# EAGLE schematic avionics_pcb_draft (EAGLE 7.6.0)

## Sheet 1 of 2
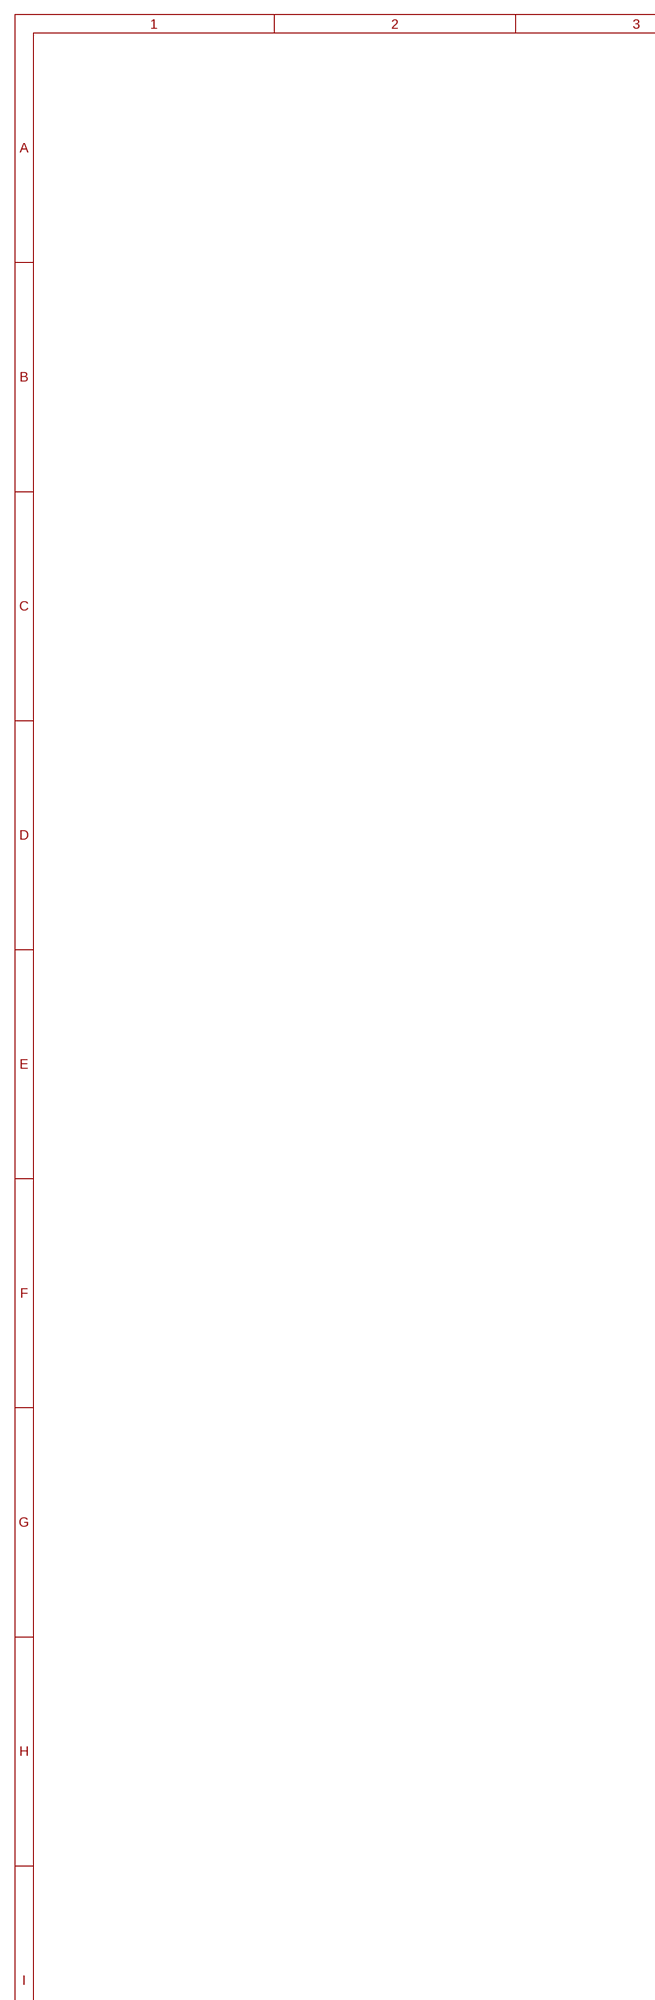
[diagram p0: schematic, sheet 1, part 1 of 2]
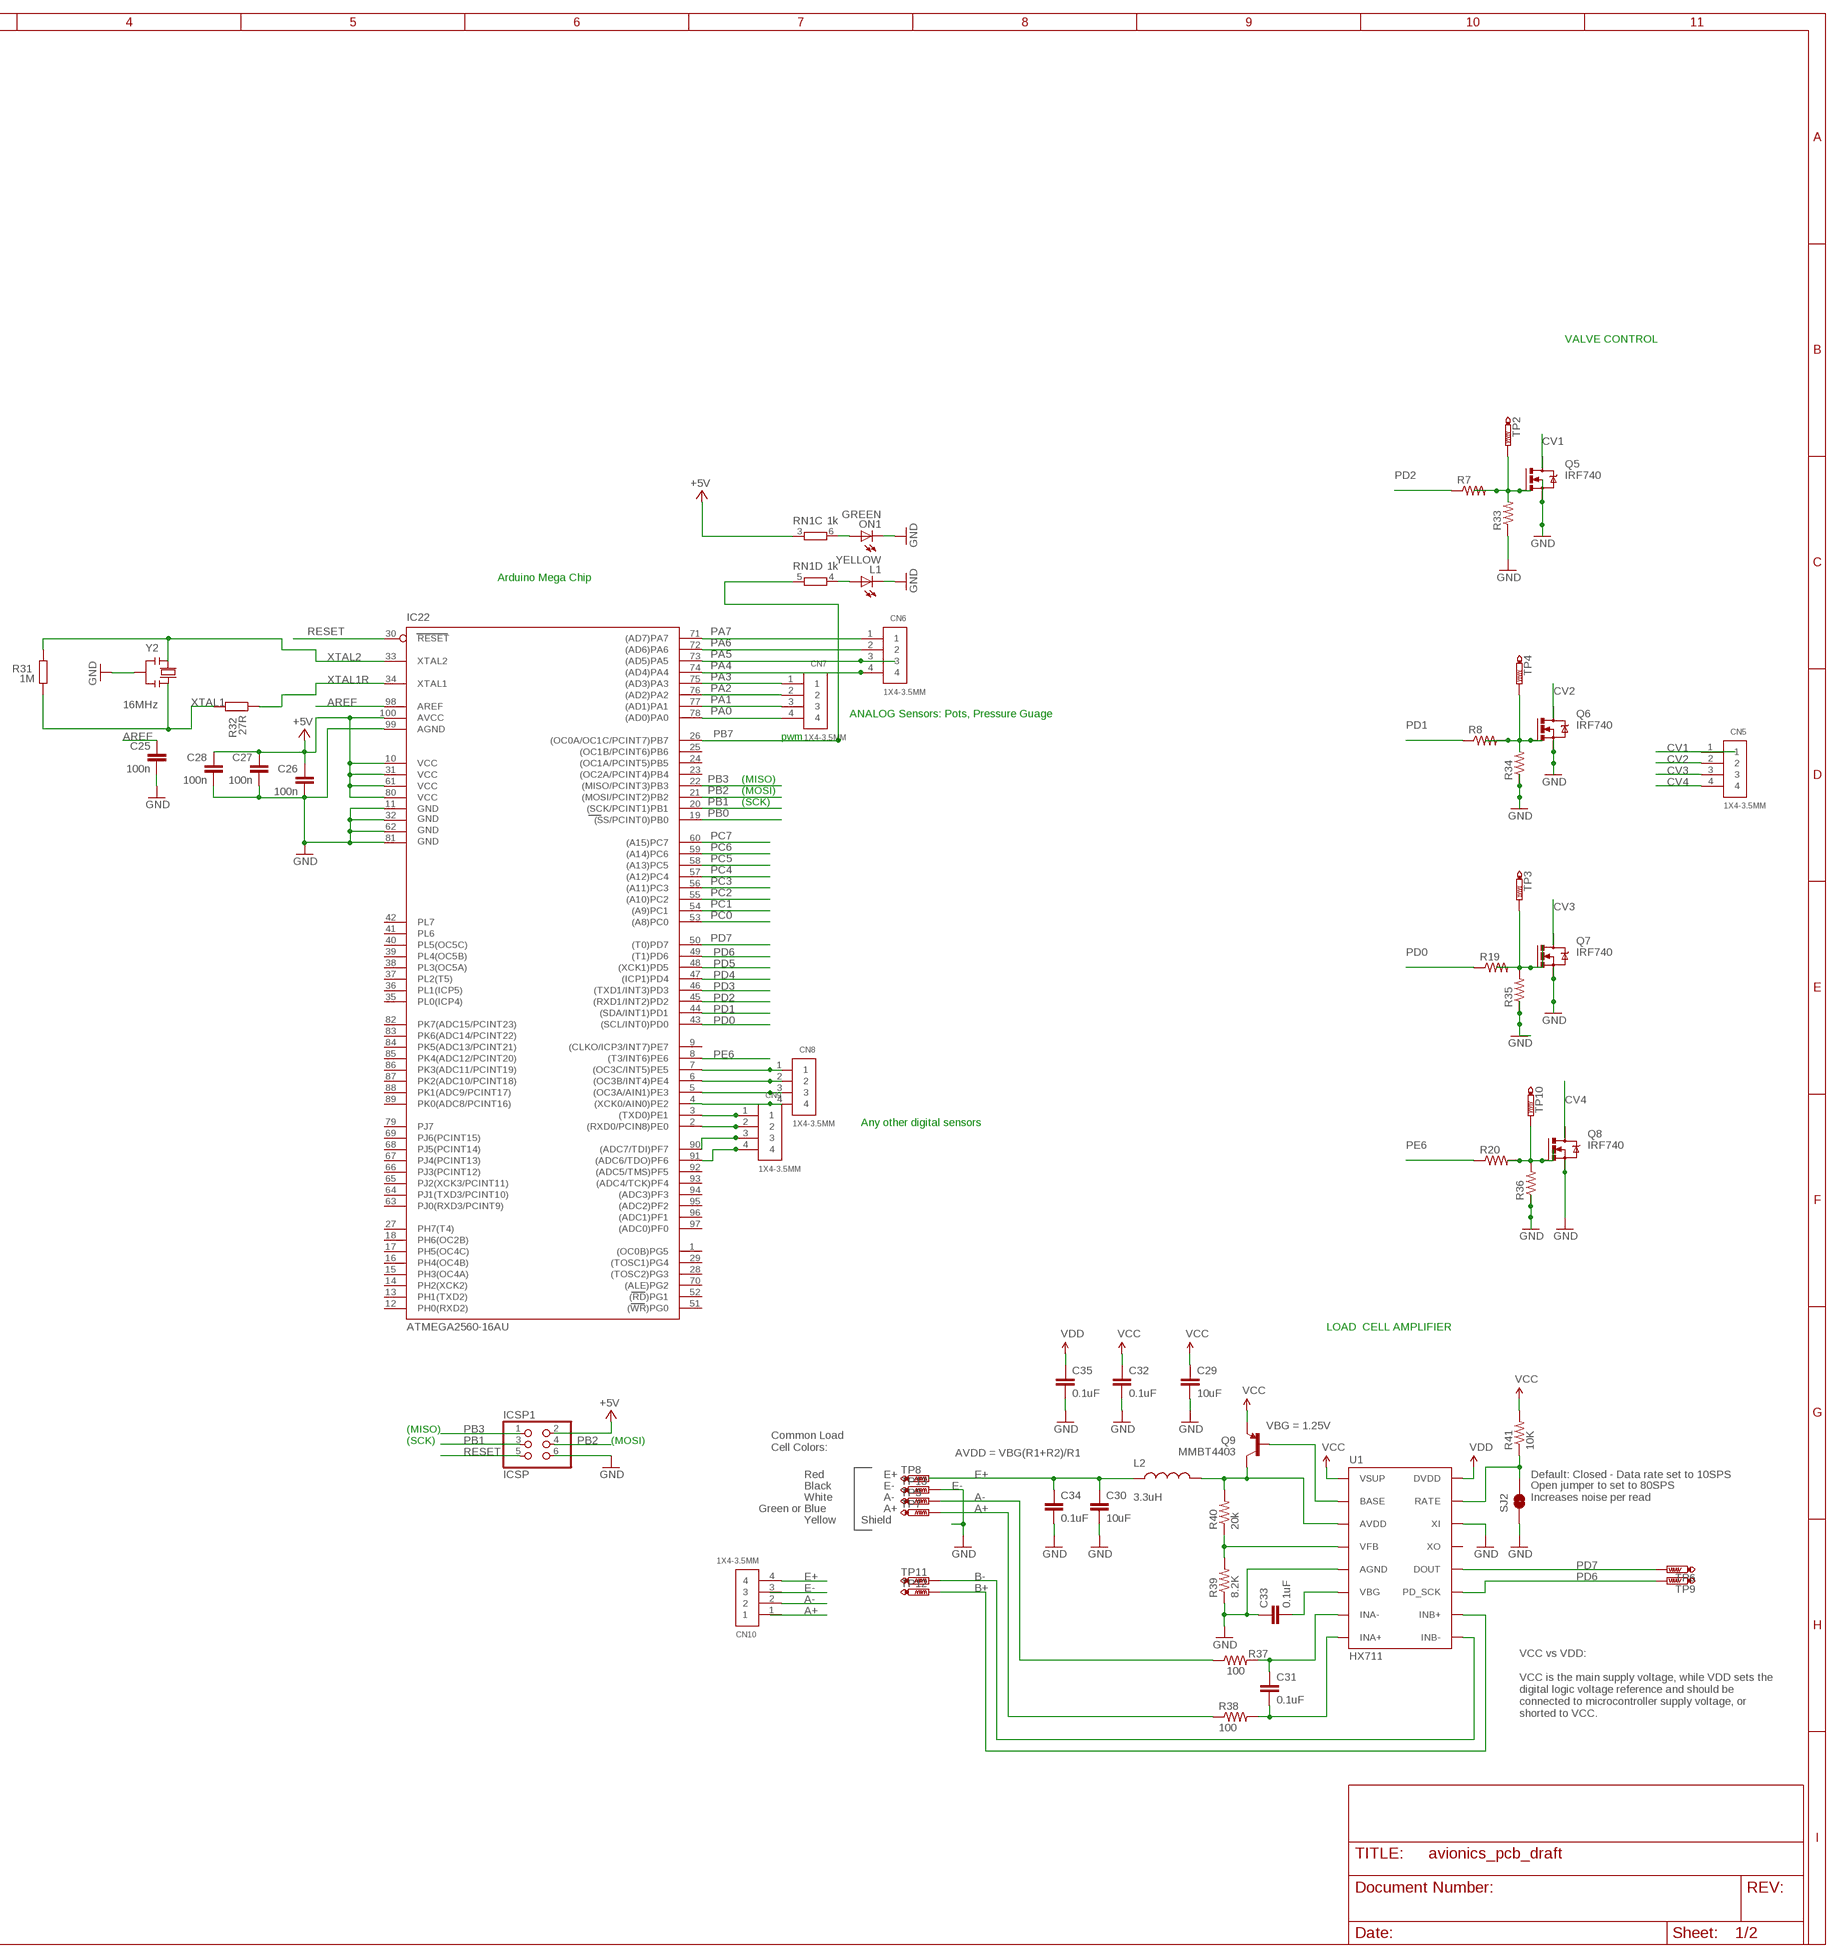
[diagram p1: schematic, sheet 1, part 2 of 2]

### Parts
C25  100n  C-EU0603-RND  [C0603-ROUND]
C26  100n  C-EU0603-RND  [C0603-ROUND]
C27  100n  C-EU0603-RND  [C0603-ROUND]
C28  100n  C-EU0603-RND  [C0603-ROUND]
C29  10uF  10UF50V20%(1210)  [1210]
C30  10uF  10UF50V20%(1210)  [1210]
C31  0.1uF  0.1UF-25V-5%(0603)  [0603-CAP]
C32  0.1uF  0.1UF-25V-5%(0603)  [0603-CAP]
C33  0.1uF  0.1UF-25V-5%(0603)  [0603-CAP]
C34  0.1uF  0.1UF-25V-5%(0603)  [0603-CAP]
C35  0.1uF  0.1UF-25V-5%(0603)  [0603-CAP]
CN5  1X4-3.5MM  [1X04-3.5MM]
CN6  1X4-3.5MM  [1X04-3.5MM]
CN7  1X4-3.5MM  [1X04-3.5MM]
CN8  1X4-3.5MM  [1X04-3.5MM]
CN9  1X4-3.5MM  [1X04-3.5MM]
CN10  1X4-3.5MM  [1X04-3.5MM]
IC22  ATMEGA2560-16AU  ATMEGA1280-16AU  [TQFP100]
ICSP1  ICSP  PINHD-2X3  [2X03]
L1  YELLOW  LEDCHIP-LED0805  [CHIP-LED0805]
L2  3.3uH  INDUCTOR0805-IND  [0805]
ON1  GREEN  LEDCHIP-LED0805  [CHIP-LED0805]
Q5  IRF740  [TO220BV]
Q6  IRF740  [TO220BV]
Q7  IRF740  [TO220BV]
Q8  IRF740  [TO220BV]
Q9  MMBT4403  TRANSISTOR_PNPMMBT4403  [SOT23-3]
R7  R-US_R0805  [R0805]
R8  R-US_R0805  [R0805]
R19  R-US_R0805  [R0805]
R20  R-US_R0805  [R0805]
R31  1M  R-EU_R0603  [R0603-ROUND]
R32  27R  R-EU_R0603  [R0603-ROUND]
R33  R-US_R0805  [R0805]
R34  R-US_R0805  [R0805]
R35  R-US_R0805  [R0805]
R36  R-US_R0805  [R0805]
R37  100  100OHM-1/10W-1%(0603)  [0603-RES]
R38  100  100OHM-1/10W-1%(0603)  [0603-RES]
R39  8.2K  8.2KOHM-1/10W-5%(0603)  [0603-RES]
R40  20k  20KOHM1/10W1%(0603)  [0603-RES]
R41  10K  10KOHM-1/10W-1%(0603)0603  [0603-RES]
RN1  1k  4R-NCAY16  [CAY16]
SJ2  JUMPER-PAD-2-NC_BY_TRACE  [PAD-JUMPER-2-NC_BY_TRACE_YES_SILK]
TP2  PTR1B1,27  [B1,27]
TP3  PTR1B1,27  [B1,27]
TP4  PTR1B1,27  [B1,27]
TP5  PTR1B1,27  [B1,27]
TP6  PTR1B1,27  [B1,27]
TP7  PTR1B1,27  [B1,27]
TP8  PTR1B1,27  [B1,27]
TP9  PTR1B1,27  [B1,27]
TP10  PTR1B1,27  [B1,27]
TP11  PTR1B1,27  [B1,27]
TP12  PTR1B1,27  [B1,27]
TP13  PTR1B1,27  [B1,27]
U1  HX711  HX711HX711  [SO16]
Y2  16MHz  RESONATORMU  [RESONATOR]

### Nets
+5V: C26.1 C27.1 C28.1 IC22.10(VCC) IC22.31(VCC1) IC22.61(VCC2) IC22.80(VCC3) IC22.100(AVCC) ICSP1.2 RN1.3 ; also sheet 2
A+: R38.1 TP7.TP
A-: CN10.2 R37.1 TP5.TP
AREF: C25.1 IC22.98(AREF)
B+: TP12.TP U1.10(INB+)
B-: TP11.TP U1.9(INB-)
CV1: CN5.1
CV2: CN5.2
CV3: CN5.3
CV4: CN5.4
E+: C30.1 C34.1 CN10.4 L2.1 TP8.TP
E-: TP13.TP ; supply symbol labelled GND
GND: C25.2 C26.2 C27.2 C28.2 C29.2 C30.2 C32.2 C33.1 C34.2 C35.2 IC22.11(GND) IC22.32(GND1) IC22.62(GND2) IC22.81(GND3) IC22.99(AGND) ICSP1.6 L1.C ON1.C Q5.S Q6.S Q7.S Q8.S R33.1 R34.1 R39.1 SJ2.1 U1.5(AGND) U1.14(XI) Y2.2 ; also sheet 2
N$1: CN8.1 IC22.7((OC3C/INT5)PE5)
N$2: R35.1 ; supply symbol labelled GND
N$3: R36.1 ; supply symbol labelled GND
N$4: CN8.2 IC22.6((OC3B/INT4)PE4)
N$5: CN8.3 IC22.5((OC3A/AIN1)PE3)
N$6: CN8.4 IC22.4((XCK0/AIN0)PE2)
N$7: Q5.G R7.2 R33.2
N$8: Q6.G R8.2 R34.2
N$9: CN9.1 IC22.3((TXD0)PE1)
N$10: CN9.2 IC22.2((RXD0/PCIN8)PE0)
N$11: CN9.3 IC22.90((ADC7/TDI)PF7)
N$12: CN9.4 IC22.91((ADC6/TDO)PF6)
N$15: TP4.TP
N$16: TP2.TP
N$29: Q7.G R19.2 R35.2 TP3.TP
N$30: Q8.G R20.2 R36.2 TP10.TP
N$51: ON1.A RN1.6
N$52: L1.A RN1.4
N$53: Q9.1(B) U1.2(BASE)
N$54: R39.2 R40.1 U1.4(VFB)
N$55: C33.2 U1.6(VBG)
N$56: L2.2 Q9.3(C) R40.2 U1.3(AVDD)
N$57: R41.1 SJ2.2 U1.15(RATE)
N$58: C31.1 R37.2 U1.7(INA-)
N$59: C31.2 R38.2 U1.8(INA+)
PA0: CN7.4 IC22.78((AD0)PA0)
PA1: CN7.3 IC22.77((AD1)PA1)
PA2: CN7.2 IC22.76((AD2)PA2)
PA3: CN7.1 IC22.75((AD3)PA3)
PA4: CN6.4 IC22.74((AD4)PA4)
PA5: CN6.3 IC22.73((AD5)PA5)
PA6: CN6.2 IC22.72((AD6)PA6)
PA7: CN6.1 IC22.71((AD7)PA7)
PB0: IC22.19((SS/PCINT0)PB0)
PB1: IC22.20((SCK/PCINT1)PB1) ICSP1.3
PB2: IC22.21((MOSI/PCINT2)PB2) ICSP1.4
PB3: IC22.22((MISO/PCINT3)PB3) ICSP1.1
PB7: IC22.26((OC0A/OC1C/PCINT7)PB7) RN1.5
PC0: IC22.53((A8)PC0)
PC1: IC22.54((A9)PC1)
PC2: IC22.55((A10)PC2)
PC3: IC22.56((A11)PC3)
PC4: IC22.57((A12)PC4)
PC5: IC22.58((A13)PC5)
PC6: IC22.59((A14)PC6)
PC7: IC22.60((A15)PC7)
PD0: IC22.43((SCL/INT0)PD0) R19.1
PD1: IC22.44((SDA/INT1)PD1) R8.1
PD2: IC22.45((RXD1/INT2)PD2) R7.1
PD3: IC22.46((TXD1/INT3)PD3) ; also sheet 2
PD4: IC22.47((ICP1)PD4) ; also sheet 2
PD5: IC22.48((XCK1)PD5) ; also sheet 2
PD6: IC22.49((T1)PD6) TP9.TP U1.11(PD_SCK)
PD7: IC22.50((T0)PD7) TP6.TP U1.12(DOUT)
PE6: IC22.8((T3/INT6)PE6) R20.1
RESET: IC22.30(RESET) ICSP1.5
VCC: C29.1 C32.1 Q9.2(E) R41.2 U1.1(VSUP)
VDD: C35.1 U1.16(DVDD)
XTAL1: R31.1 R32.2 Y2.3
XTAL1R: IC22.34(XTAL1) R32.1
XTAL2: IC22.33(XTAL2) R31.2 Y2.1
Unconnected: CN10.1 CN10.3 IC22.1((OC0B)PG5) IC22.9((CLKO/ICP3/INT7)PE7) IC22.12(PH0(RXD2)) IC22.13(PH1(TXD2)) IC22.14(PH2(XCK2)) IC22.15(PH3(OC4A)) IC22.16(PH4(OC4B)) IC22.17(PH5(OC4C)) IC22.18(PH6(OC2B)) IC22.23((OC2A/PCINT4)PB4) IC22.24((OC1A/PCINT5)PB5) IC22.25((OC1B/PCINT6)PB6) IC22.27(PH7(T4)) IC22.28((TOSC2)PG3) IC22.29((TOSC1)PG4) IC22.35(PL0(ICP4)) IC22.36(PL1(ICP5)) IC22.37(PL2(T5)) IC22.38(PL3(OC5A)) IC22.39(PL4(OC5B)) IC22.40(PL5(OC5C)) IC22.41(PL6) IC22.42(PL7) IC22.51((WR)PG0) IC22.52((RD)PG1) IC22.63(PJ0(RXD3/PCINT9)) IC22.64(PJ1(TXD3/PCINT10)) IC22.65(PJ2(XCK3/PCINT11)) IC22.66(PJ3(PCINT12)) IC22.67(PJ4(PCINT13)) IC22.68(PJ5(PCINT14)) IC22.69(PJ6(PCINT15)) IC22.70((ALE)PG2) IC22.79(PJ7) IC22.82(PK7(ADC15/PCINT23)) IC22.83(PK6(ADC14/PCINT22)) IC22.84(PK5(ADC13/PCINT21)) IC22.85(PK4(ADC12/PCINT20)) IC22.86(PK3(ADC11/PCINT19)) IC22.87(PK2(ADC10/PCINT18)) IC22.88(PK1(ADC9/PCINT17)) IC22.89(PK0(ADC8/PCINT16)) IC22.92((ADC5/TMS)PF5) IC22.93((ADC4/TCK)PF4) IC22.94((ADC3)PF3) IC22.95((ADC2)PF2) IC22.96((ADC1)PF1) IC22.97((ADC0)PF0) Q5.D Q6.D Q7.D Q8.D RN1.1 RN1.2 RN1.7 RN1.8 U1.13(XO)

### Notes on the sheet
- VALVE CONTROL
- Arduino Mega Chip
- ANALOG Sensors: Pots, Pressure Guage
- pwm
- (MISO)
- (MOSI)
- (SCK)
- Any other digital sensors
- LOAD  CELL AMPLIFIER
- VBG = 1.25V
- (MISO)
- (SCK) | (MOSI)
- Common Load
  Cell Colors:
- AVDD = VBG(R1+R2)/R1
- Red | E+ | Default: Closed - Data rate set to 10SPS
- Black | E-
- White | A-
- Open jumper to set to 80SPS
  Increases noise per read
- Green or Blue | A+
- Yellow | Shield
- VCC vs VDD:
  
  VCC is the main supply voltage, while VDD sets the
  digital logic voltage reference and should be
  connected to microcontroller supply voltage, or
  shorted to VCC.

## Sheet 2 of 2
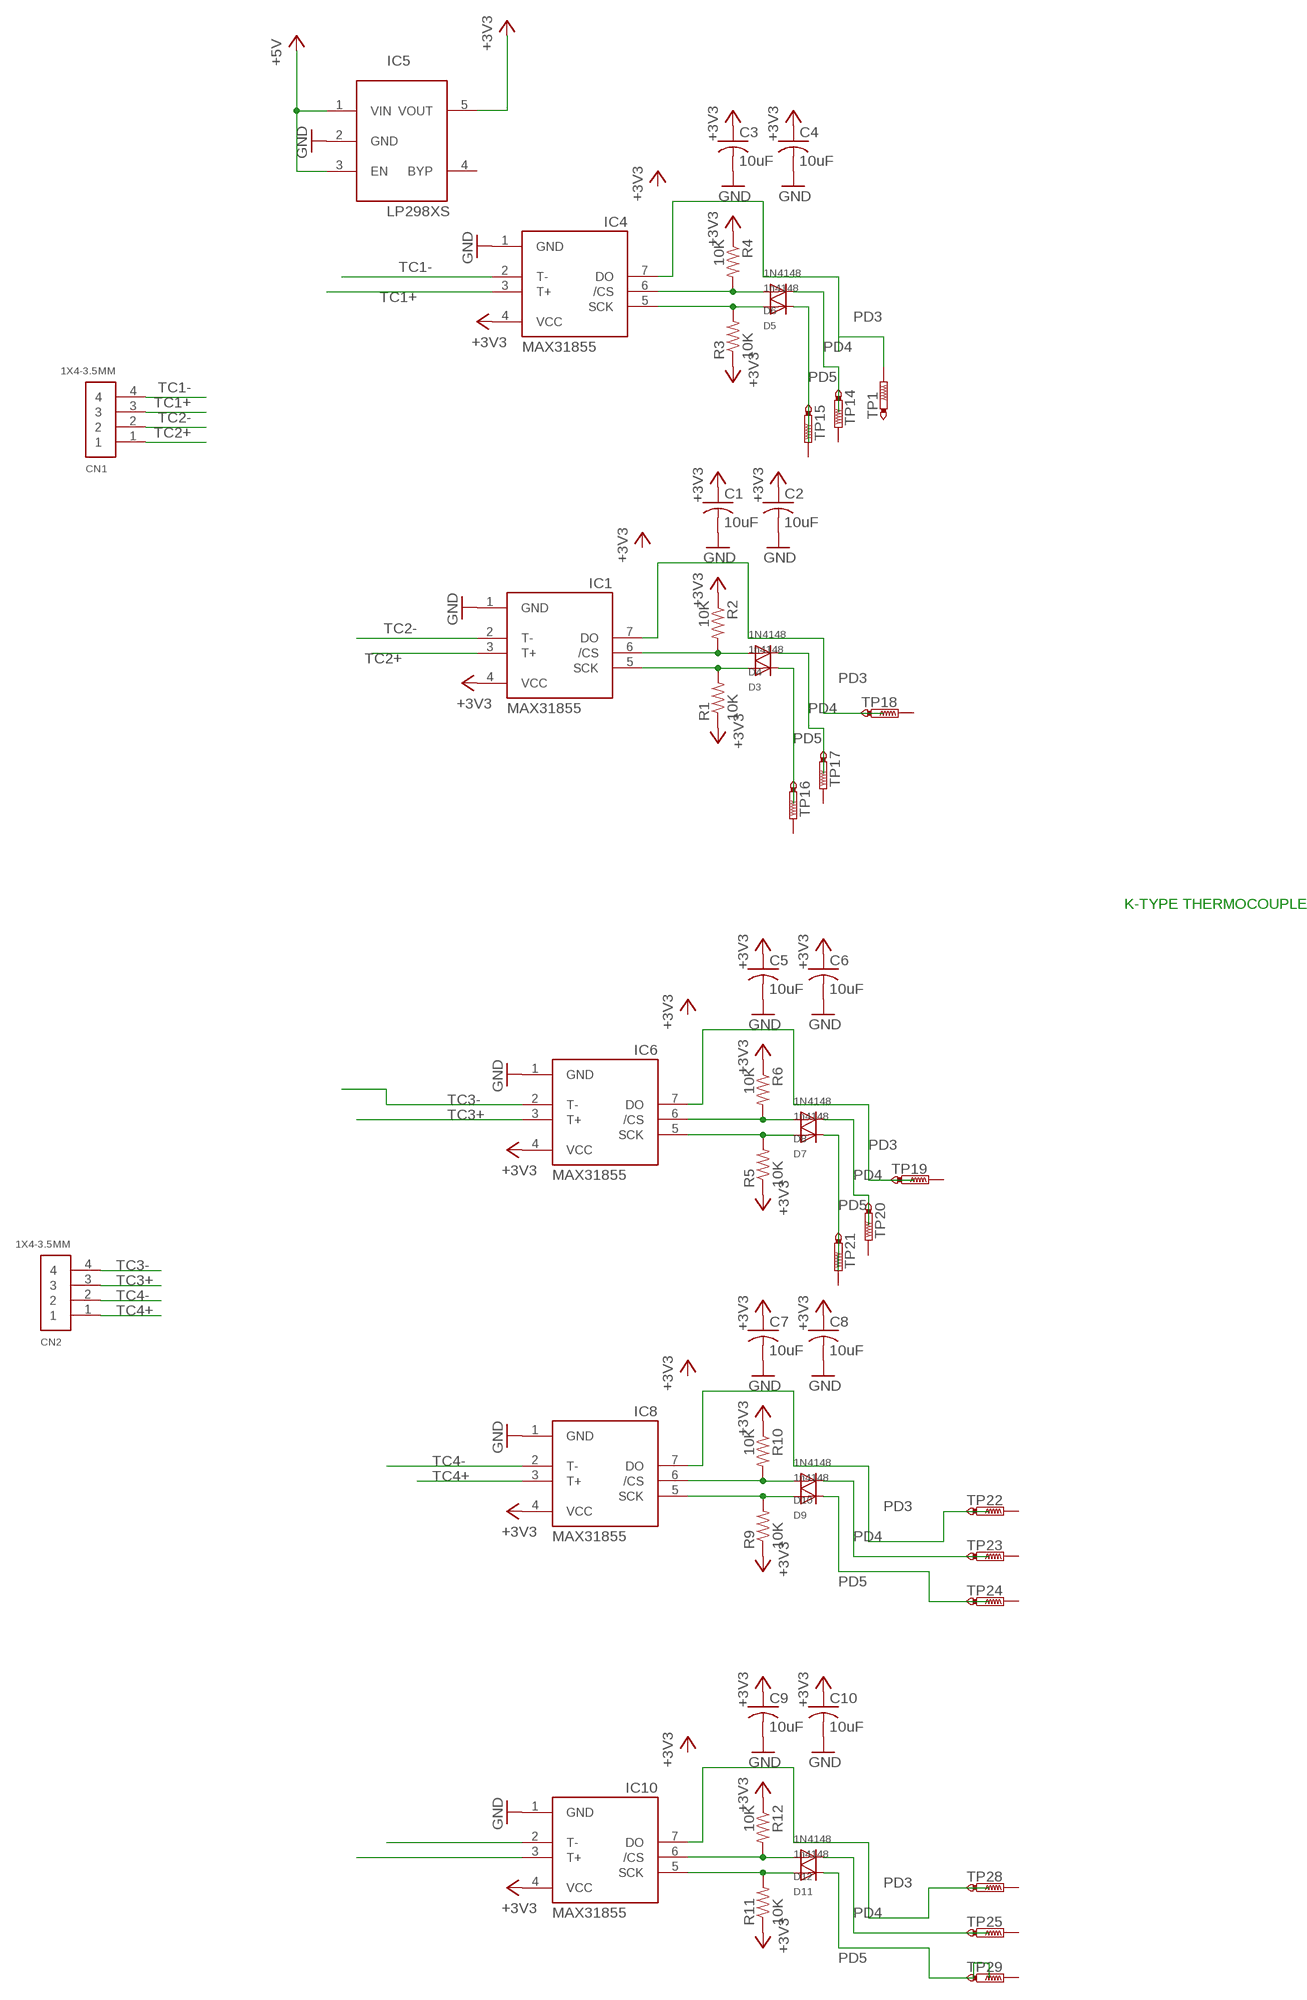
[diagram p2: schematic, sheet 2]

### Parts
C1  10uF  C-USC0805K  [C0805K]
C2  10uF  C-USC0805K  [C0805K]
C3  10uF  C-USC0805K  [C0805K]
C4  10uF  C-USC0805K  [C0805K]
C5  10uF  C-USC0805K  [C0805K]
C6  10uF  C-USC0805K  [C0805K]
C7  10uF  C-USC0805K  [C0805K]
C8  10uF  C-USC0805K  [C0805K]
C9  10uF  C-USC0805K  [C0805K]
C10  10uF  C-USC0805K  [C0805K]
CN1  1X4-3.5MM  [1X04-3.5MM]
CN2  1X4-3.5MM  [1X04-3.5MM]
D3  1n4148  DIODESOD-323F  [SOD-323F]
D4  1N4148  DIODESOD-323F  [SOD-323F]
D5  1n4148  DIODESOD-323F  [SOD-323F]
D6  1N4148  DIODESOD-323F  [SOD-323F]
D7  1n4148  DIODESOD-323F  [SOD-323F]
D8  1N4148  DIODESOD-323F  [SOD-323F]
D9  1n4148  DIODESOD-323F  [SOD-323F]
D10  1N4148  DIODESOD-323F  [SOD-323F]
D11  1n4148  DIODESOD-323F  [SOD-323F]
D12  1N4148  DIODESOD-323F  [SOD-323F]
IC1  MAX31855  MAX6675  [SO08]
IC4  MAX31855  MAX6675  [SO08]
IC5  LP298XS  [SOT23-5L]
IC6  MAX31855  MAX6675  [SO08]
IC8  MAX31855  MAX6675  [SO08]
IC10  MAX31855  MAX6675  [SO08]
R1  10K  R-US_R0805  [R0805]
R2  10K  R-US_R0805  [R0805]
R3  10K  R-US_R0805  [R0805]
R4  10K  R-US_R0805  [R0805]
R5  10K  R-US_R0805  [R0805]
R6  10K  R-US_R0805  [R0805]
R9  10K  R-US_R0805  [R0805]
R10  10K  R-US_R0805  [R0805]
R11  10K  R-US_R0805  [R0805]
R12  10K  R-US_R0805  [R0805]
TP1  PTR1B1,27  [B1,27]
TP14  PTR1B1,27  [B1,27]
TP15  PTR1B1,27  [B1,27]
TP16  PTR1B1,27  [B1,27]
TP17  PTR1B1,27  [B1,27]
TP18  PTR1B1,27  [B1,27]
TP19  PTR1B1,27  [B1,27]
TP20  PTR1B1,27  [B1,27]
TP21  PTR1B1,27  [B1,27]
TP22  PTR1B1,27  [B1,27]
TP23  PTR1B1,27  [B1,27]
TP24  PTR1B1,27  [B1,27]
TP25  PTR1B1,27  [B1,27]
TP28  PTR1B1,27  [B1,27]
TP29  PTR1B1,27  [B1,27]

### Nets
+3V3: C1.1 C2.1 C3.1 C4.1 C5.1 C6.1 C7.1 C8.1 C9.1 C10.1 IC1.4(VCC) IC4.4(VCC) IC5.5(VOUT) IC6.4(VCC) IC8.4(VCC) IC10.4(VCC) R1.1 R2.1 R3.1 R4.1 R5.1 R6.1 R9.1 R10.1 R11.1 R12.1
+5V: IC5.1(VIN) IC5.3(EN) ; also sheet 1
CS1: D4.A IC1.6(/CS) R2.2
CS2: D6.A IC4.6(/CS) R4.2
CS3: D8.A IC6.6(/CS) R6.2
CS4: D10.A IC8.6(/CS) R10.2
CS5: D12.A IC10.6(/CS) R12.2
GND: C1.2 C2.2 C3.2 C4.2 C5.2 C6.2 C7.2 C8.2 C9.2 C10.2 IC1.1(GND) IC4.1(GND) IC5.2(GND) IC6.1(GND) IC8.1(GND) IC10.1(GND) ; also sheet 1
N$22: IC10.3(T+)
N$25: IC10.2(T-)
PD3: IC1.7(DO) IC4.7(DO) IC6.7(DO) IC8.7(DO) IC10.7(DO) TP1.TP ; also sheet 1
PD4: D4.C D6.C D8.C D10.C D12.C ; also sheet 1
PD5: D3.C D5.C D7.C D9.C D11.C ; also sheet 1
SCK1: D3.A IC1.5(SCK) R1.2
SCK2: D5.A IC4.5(SCK) R3.2
SCK3: D7.A IC6.5(SCK) R5.2
SCK4: D9.A IC8.5(SCK) R9.2
SCK5: D11.A IC10.5(SCK) R11.2
TC1+: CN1.3 IC4.3(T+)
TC1-: CN1.4 IC4.2(T-)
TC2+: CN1.1 IC1.3(T+)
TC2-: CN1.2 IC1.2(T-)
TC3+: CN2.3 IC6.3(T+)
TC3-: CN2.4 IC6.2(T-)
TC4+: CN2.1 IC8.3(T+)
TC4-: CN2.2 IC8.2(T-)
Unconnected: IC5.4(BYP) TP14.TP TP15.TP TP16.TP TP17.TP TP18.TP TP19.TP TP20.TP TP21.TP TP22.TP TP23.TP TP24.TP TP25.TP TP28.TP TP29.TP

### Notes on the sheet
- K-TYPE THERMOCOUPLES

## Library data of the parts
C1-C10 = adafruit:C-US: CAPACITOR, American symbol
C25-C28 = SmartPrj:C-EU: CAPACITOR, European symbol
C29 C30 = SparkFun-Capacitors:10UF50V20%(1210): CAP-09824; PROD_ID: CAP-09824
C31-C35 = SparkFun-Capacitors:0.1UF-25V-5%(0603): CAP-08604; PROD_ID: CAP-08604
CN1 CN2 CN5-CN10 = adafruit:1X4: 4-pin connector
D3-D12 = adafruit:DIODE: Diode SMADIODE - SMA Surface Mount Package 20V 1A Schottky Diode Digikey: 641-1014-6-ND DO-1N4148 - Through Hole Small Current Diode SOD-123 20V 1 A (.5mV Vf) Schottky Diode - Digikey: MBRX120TPMSCT-ND SOD-323 10V 570mA (.38mV Vf, 3ns) Schottky Diode - Digikey: ZLLS410CT-ND SOD-523 30V 30mA Schottky Diode (RB751S-40TE61) - Digikey: RB751S-40TE61CT-ND SOT23-R/W - SOT23 Package (R = Solder Paste/Reflow Ovens, W = Hand-Soldering) BAT54Film 40V 300mA - Digikey: 497-7162-1-ND
IC1 IC4 IC6 IC8 IC10 = adafruit:MAX6675
IC5 = adafruit:LP298X
IC22 = atmel-2005:ATMEGA*: MICROCONTROLLER 64/128/256 Kbytes FLASH 4 Kbytes EEPROM 8 Kbytes SRAM 86 General Purpose I/O pins 12-channels16-bit PWM 4 x Serial USARTs 16-channels 10-bit A/D
ICSP1 = pinhead:PINHD-2X3: PIN HEADER
L1 ON1 = led:LED: LED OSRAM: - CHIPLED LG R971, LG N971, LY N971, LG Q971, LY Q971, LO R971, LY R971 LH N974, LH R974 LS Q976, LO Q976, LY Q976 LO Q996 - Hyper CHIPLED LW Q18S LB Q993, LB Q99A, LB R99A - SideLED LS A670, LO A670, LY A670, LG A670, LP A670 LB A673, LV A673, LT A673, LW A673 LH A674 LY A675 LS A676, LA A676, LO A676, LY A676, LW A676 LS A679, LY A679, LG A679 - Hyper Micro SIDELED® LS Y876, LA Y876, LO Y876, LY Y876 LT Y87S - SmartLED LW L88C, LW L88S LB L89C, LB L89S, LG L890 LS L89K, LO L89K, LY L89K LS L896, LA L896, LO L896, LY L896 - TOPLED LS T670, LO T670, LY T670, LG T670, LP T670 LSG T670, LSP T670, LSY T670, LOP T670, LYG T670 LG T671, LOG T671, LSG T671 LB T673, LV T673, LT T673, LW T673 LH T674 LS T676, LA T676, LO T676, LY T676, LB T676, LH T676, LSB T676, LW T676 LB T67C, LV T67C, LT T67C, LS T67K, LO T67K, LY T67K, LW E67C LS E67B, LA E67B, LO E67B, LY E67B, LB E67C, LV E67C, LT E67C LW T67C LS T679, LY T679, LG T679 LS T770, LO T770, LY T770, LG T770, LP T770 LB T773, LV T773, LT T773, LW T773 LH T774 LS E675, LA E675, LY E675, LS T675 LS T776, LA T776, LO T776, LY T776, LB T776 LHGB T686 LT T68C, LB T68C - Hyper Mini TOPLED® LB M676 - Mini TOPLED Santana® LG M470 LS M47K, LO M47K, LY M47K Source: http://www.osram.convergy.de LUXEON: - LUMILED® LXK2-PW12-R00, LXK2-PW12-S00, LXK2-PW14-U00, LXK2-PW14-V00 LXK2-PM12-R00, LXK2-PM12-S00, LXK2-PM14-U00 LXK2-PE12-Q00, LXK2-PE12-R00, LXK2-PE12-S00, LXK2-PE14-T00, LXK2-PE14-U00 LXK2-PB12-K00, LXK2-PB12-L00, LXK2-PB12-M00, LXK2-PB14-N00, LXK2-PB14-P00, LXK2-PB14-Q00 LXK2-PR12-L00, LXK2-PR12-M00, LXK2-PR14-Q00, LXK2-PR14-R00 LXK2-PD12-Q00, LXK2-PD12-R00, LXK2-PD12-S00 LXK2-PH12-R00, LXK2-PH12-S00 LXK2-PL12-P00, LXK2-PL12-Q00, LXK2-PL12-R00 Source: www.luxeon.com KINGBRIGHT: KA-3528ASYC Source: www.kingbright.com
L2 = SparkFun-Passives:INDUCTOR: Inductors Basic Inductor/Choke - 0603 and 1206. Footprints are not proven and vary greatly between part numbers. INDUCTOR POWER 3.3UH 4.0A SMD 0.197" L x 0.197" W x 0.177" H (5.00mm x 5.00mm x 4.50mm); PROD_ID: NDUC-13076
Q5-Q8 = transistor-power:IRF740: N-CHANNEL MOS FET
Q9 = SparkFun-DiscreteSemi:TRANSISTOR_PNP: Generic PNP BJT Double check pinouts against datasheets- not all devices are the same! MMBT3906 - 40V 200mA SOT-23 (TRANS-08052) MMBT4403 - 40V 600mA SOT-23 (TRANS-09245); PROD_ID: TRANS-09245
R1-R12 R19 R20 R33-R36 = adafruit:R-US_: RESISTOR, American symbol
R31 R32 = SmartPrj:R-EU_: RESISTOR, European symbol
R37 R38 = SparkFun-Resistors:100OHM-1/10W-1%(0603): RES-07863; PROD_ID: RES-07863
R39 = SparkFun-Resistors:8.2KOHM-1/10W-5%(0603): RES-10646; PROD_ID: RES-10646
R40 = SparkFun-Resistors:20KOHM1/10W1%(0603): RES-09383; PROD_ID: RES-09383
R41 = SparkFun-Resistors:10KOHM-1/10W-1%(0603): RES-00824; PROD_ID: RES-00824
RN1 = resistor-dil:4R-N: Array Chip Resistor Source: RS Component / Phycomp
SJ2 = SparkFun-Passives:JUMPER-PAD-2-NC_BY_TRACE
TP1-TP25 TP28 TP29 = testpad:PTR1: TEST PIN
U1 = Testing:HX711; PROD_ID: IC-12445
Y2 = SmartPrj:RESONATOR